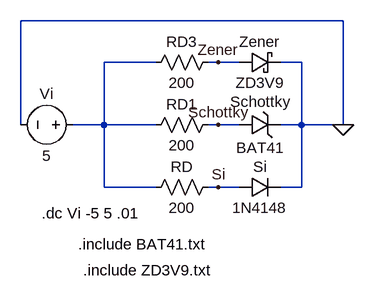
[diagram p0: schematic Versuch01_Lab1.asc]
Versuch01_Lab1.asc, the LTspice schematic file:
Version 4
SHEET 1 1456 680
WIRE 432 -224 -64 -224
WIRE 144 -160 64 -160
WIRE 240 -160 224 -160
WIRE 272 -160 240 -160
WIRE 368 -160 336 -160
WIRE -64 -64 -64 -224
WIRE 64 -64 64 -160
WIRE 64 -64 16 -64
WIRE 144 -64 64 -64
WIRE 240 -64 224 -64
WIRE 272 -64 240 -64
WIRE 368 -64 368 -160
WIRE 368 -64 336 -64
WIRE 432 -64 432 -224
WIRE 432 -64 368 -64
WIRE 64 32 64 -64
WIRE 144 32 64 32
WIRE 240 32 224 32
WIRE 272 32 240 32
WIRE 368 32 368 -64
WIRE 368 32 336 32
FLAG 240 32 Si
FLAG 240 -64 Schottky
FLAG 240 -160 Zener
FLAG 432 -64 0
SYMBOL res 240 16 R90
WINDOW 0 0 56 VBottom 2
WINDOW 3 32 56 VTop 2
SYMATTR InstName RD
SYMATTR Value 200
SYMBOL diode 272 48 R270
WINDOW 0 32 32 VTop 2
WINDOW 3 0 32 VBottom 2
SYMATTR InstName Si
SYMATTR Value 1N4148
SYMBOL schottky 272 -144 R270
WINDOW 0 32 32 VTop 2
WINDOW 3 0 32 VBottom 2
SYMATTR InstName Zener
SYMATTR Value ZD3V9
SYMATTR Prefix X
SYMBOL res 240 -80 R90
WINDOW 0 0 56 VBottom 2
WINDOW 3 32 56 VTop 2
SYMATTR InstName RD1
SYMATTR Value 200
SYMBOL res 240 -176 R90
WINDOW 0 0 56 VBottom 2
WINDOW 3 32 56 VTop 2
SYMATTR InstName RD3
SYMATTR Value 200
SYMBOL zener 272 -48 R270
WINDOW 0 36 32 VTop 2
WINDOW 3 -4 32 VBottom 2
SYMATTR InstName Schottky
SYMATTR Value BAT41
SYMATTR Prefix X
SYMBOL voltage 32 -64 R90
WINDOW 0 -32 56 VBottom 2
WINDOW 3 32 56 VTop 2
SYMATTR InstName Vi
SYMATTR Value 5
TEXT -32 72 Left 2 !.dc Vi -5 5 .01
TEXT 24 120 Left 2 !.include BAT41.txt
TEXT 32 160 Left 2 !.include ZD3V9.txt

The netlist it stands for:
* Versuch01_Lab1.asc
RD Si N001 200
D§Si Si 0 1N4148
XZener Zener 0 ZD3V9  ; pins + -
RD1 Schottky N001 200
RD3 Zener N001 200
XSchottky Schottky 0 BAT41  ; pins + -
Vi N001 0 5
.model D D
.lib standard.dio
.dc Vi -5 5 .01
.include BAT41.txt
.include ZD3V9.txt
.backanno
.end